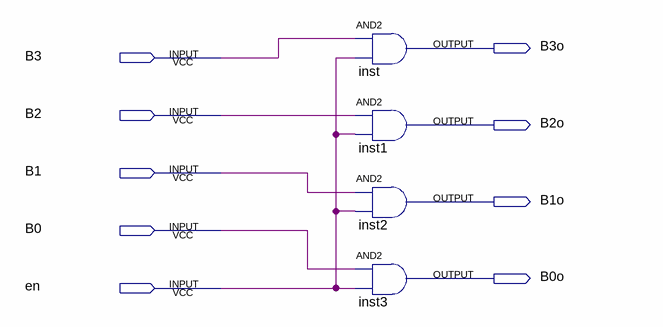
[diagram p0: schematic sheet]
// Quartus schematic mux.bdf as structural Verilog: 4 symbols, 9 pins
module mux (
  input  B3,
  input  B2,
  input  B1,
  input  B0,
  input  en,
  output B3o,
  output B2o,
  output B1o,
  output B0o
);

  and inst (B3o, B3, en);
  and inst1 (B2o, B2, en);
  and inst2 (B1o, B1, en);
  and inst3 (B0o, B0, en);
endmodule
